# Altium schematic sheet IDC_EXT_Connectors.SchDoc
size 420 x 297 mm; DocumentNumber: 5; SheetNumber: 5; SheetTotal: 8; EDA_Number: ARTIQ; ModifiedBy: -; Title2: -; DivGrp: ISE; ModifiedDate: -
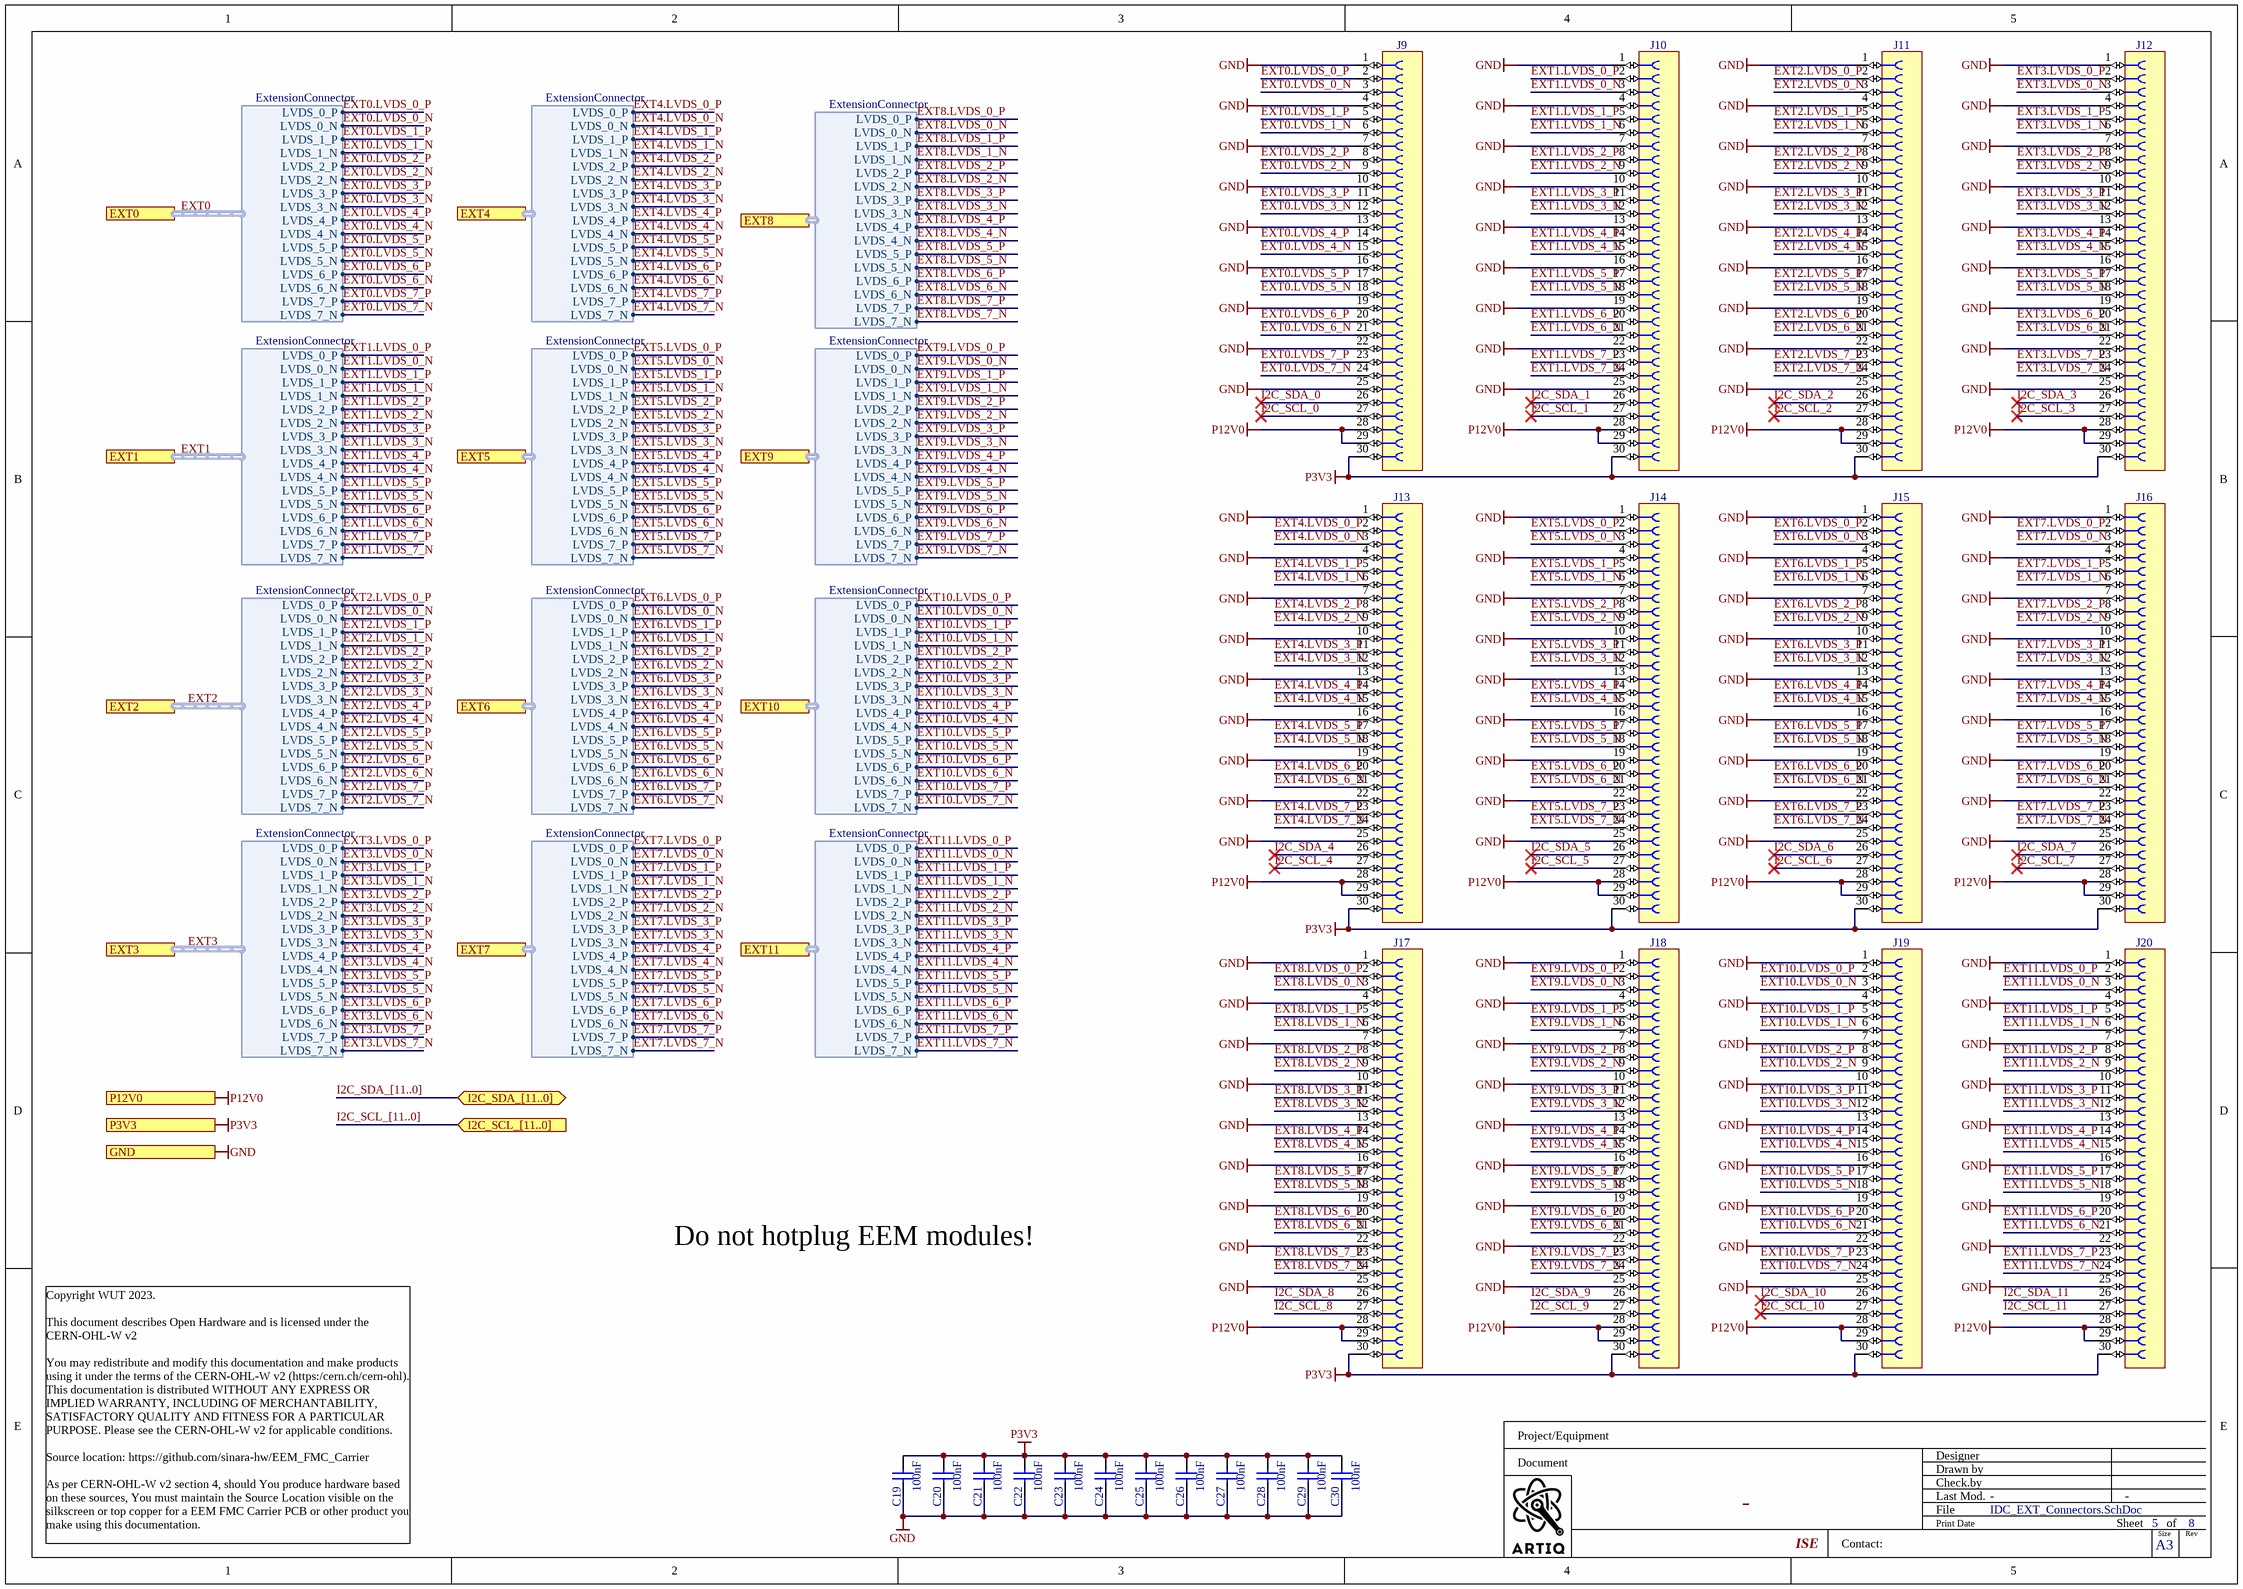
[diagram p0: IDC_EXT_Connectors.SchDoc]

## Parts
C19  100nF  [CAPC0603X33N]
C20  100nF  [CAPC0603X33N]
C21  100nF  [CAPC0603X33N]
C22  100nF  [CAPC0603X33N]
C23  100nF  [CAPC0603X33N]
C24  100nF  [CAPC0603X33N]
C25  100nF  [CAPC0603X33N]
C26  100nF  [CAPC0603X33N]
C27  100nF  [CAPC0603X33N]
C28  100nF  [CAPC0603X33N]
C29  100nF  [CAPC0603X33N]
C30  100nF  [CAPC0603X33N]
J9  (no value)  [SAMTEC_ESW-115-44-L-D]
J10  (no value)  [SAMTEC_ESW-115-44-L-D]
J11  (no value)  [SAMTEC_ESW-115-44-L-D]
J12  (no value)  [SAMTEC_ESW-115-44-L-D]
J13  (no value)  [SAMTEC_ESW-115-44-L-D]
J14  (no value)  [SAMTEC_ESW-115-44-L-D]
J15  (no value)  [SAMTEC_ESW-115-44-L-D]
J16  (no value)  [SAMTEC_ESW-115-44-L-D]
J17  (no value)  [SAMTEC_ESW-115-44-L-D]
J18  (no value)  [SAMTEC_ESW-115-44-L-D]
J19  (no value)  [SAMTEC_ESW-115-44-L-D]
J20  (no value)  [SAMTEC_ESW-115-44-L-D]

## Ports
EXT0 (harness ExtensionConnector), EXT1 (harness ExtensionConnector), EXT2 (harness ExtensionConnector), EXT3 (harness ExtensionConnector), EXT4 (harness ExtensionConnector), EXT5 (harness ExtensionConnector), EXT6 (harness ExtensionConnector), EXT7 (harness ExtensionConnector), EXT8 (harness ExtensionConnector), EXT9 (harness ExtensionConnector), EXT10 (harness ExtensionConnector), EXT11 (harness ExtensionConnector), GND, I2C_SCL_[11..0] (in), I2C_SDA_[11..0] (bidir), P3V3 (out), P12V0 (in)

## Harnesses
ExtensionConnector: LVDS_0_N, LVDS_0_P, LVDS_1_N, LVDS_1_P, LVDS_2_N, LVDS_2_P, LVDS_3_N, LVDS_3_P, LVDS_4_N, LVDS_4_P, LVDS_5_N, LVDS_5_P, LVDS_6_N, LVDS_6_P, LVDS_7_N, LVDS_7_P

## Nets
GND: C19.1 C20.1 C21.1 C22.1 C23.1 C24.1 C25.1 C26.1 C27.1 C28.1 C29.1 C30.1 J9.1 J9.4 J9.7 J9.10 J9.13 J9.16 J9.19 J9.22 J9.25 J10.1 J10.4 J10.7 J10.10 J10.13 J10.16 J10.19 J10.22 J10.25 J11.1 J11.4 J11.7 J11.10 J11.13 J11.16 J11.19 J11.22 J11.25 J12.1 J12.4 J12.7 J12.10 J12.13 J12.16 J12.19 J12.22 J12.25 J13.1 J13.4 J13.7 J13.10 J13.13 J13.16 J13.19 J13.22 J13.25 J14.1 J14.4 J14.7 J14.10 J14.13 J14.16 J14.19 J14.22 J14.25 J15.1 J15.4 J15.7 J15.10 J15.13 J15.16 J15.19 J15.22 J15.25 J16.1 J16.4 J16.7 J16.10 J16.13 J16.16 J16.19 J16.22 J16.25 J17.1 J17.4 J17.7 J17.10 J17.13 J17.16 J17.19 J17.22 J17.25 J18.1 J18.4 J18.7 J18.10 J18.13 J18.16 J18.19 J18.22 J18.25 J19.1 J19.4 J19.7 J19.10 J19.13 J19.16 J19.19 J19.22 J19.25 J20.1 J20.4 J20.7 J20.10 J20.13 J20.16 J20.19 J20.22 J20.25 ; port GND
P3V3: C19.2 C20.2 C21.2 C22.2 C23.2 C24.2 C25.2 C26.2 C27.2 C28.2 C29.2 C30.2 J9.30 J10.30 J11.30 J12.30 J13.30 J14.30 J15.30 J16.30 J17.30 J18.30 J19.30 J20.30 ; port P3V3
P12V0: J9.28 J9.29 J10.28 J10.29 J11.28 J11.29 J12.28 J12.29 J13.28 J13.29 J14.28 J14.29 J15.28 J15.29 J16.28 J16.29 J17.28 J17.29 J18.28 J18.29 J19.28 J19.29 J20.28 J20.29 ; port P12V0
EXT0.LVDS_0_N: J9.3 ; port EXT0.LVDS_0_N
EXT0.LVDS_0_P: J9.2 ; port EXT0.LVDS_0_P
EXT0.LVDS_1_N: J9.6 ; port EXT0.LVDS_1_N
EXT0.LVDS_1_P: J9.5 ; port EXT0.LVDS_1_P
EXT0.LVDS_2_N: J9.9 ; port EXT0.LVDS_2_N
EXT0.LVDS_2_P: J9.8 ; port EXT0.LVDS_2_P
EXT0.LVDS_3_N: J9.12 ; port EXT0.LVDS_3_N
EXT0.LVDS_3_P: J9.11 ; port EXT0.LVDS_3_P
EXT0.LVDS_4_N: J9.15 ; port EXT0.LVDS_4_N
EXT0.LVDS_4_P: J9.14 ; port EXT0.LVDS_4_P
EXT0.LVDS_5_N: J9.18 ; port EXT0.LVDS_5_N
EXT0.LVDS_5_P: J9.17 ; port EXT0.LVDS_5_P
EXT0.LVDS_6_N: J9.21 ; port EXT0.LVDS_6_N
EXT0.LVDS_6_P: J9.20 ; port EXT0.LVDS_6_P
EXT0.LVDS_7_N: J9.24 ; port EXT0.LVDS_7_N
EXT0.LVDS_7_P: J9.23 ; port EXT0.LVDS_7_P
EXT1.LVDS_0_N: J10.3 ; port EXT1.LVDS_0_N
EXT1.LVDS_0_P: J10.2 ; port EXT1.LVDS_0_P
EXT1.LVDS_1_N: J10.6 ; port EXT1.LVDS_1_N
EXT1.LVDS_1_P: J10.5 ; port EXT1.LVDS_1_P
EXT1.LVDS_2_N: J10.9 ; port EXT1.LVDS_2_N
EXT1.LVDS_2_P: J10.8 ; port EXT1.LVDS_2_P
EXT1.LVDS_3_N: J10.12 ; port EXT1.LVDS_3_N
EXT1.LVDS_3_P: J10.11 ; port EXT1.LVDS_3_P
EXT1.LVDS_4_N: J10.15 ; port EXT1.LVDS_4_N
EXT1.LVDS_4_P: J10.14 ; port EXT1.LVDS_4_P
EXT1.LVDS_5_N: J10.18 ; port EXT1.LVDS_5_N
EXT1.LVDS_5_P: J10.17 ; port EXT1.LVDS_5_P
EXT1.LVDS_6_N: J10.21 ; port EXT1.LVDS_6_N
EXT1.LVDS_6_P: J10.20 ; port EXT1.LVDS_6_P
EXT1.LVDS_7_N: J10.24 ; port EXT1.LVDS_7_N
EXT1.LVDS_7_P: J10.23 ; port EXT1.LVDS_7_P
EXT2.LVDS_0_N: J11.3 ; port EXT2.LVDS_0_N
EXT2.LVDS_0_P: J11.2 ; port EXT2.LVDS_0_P
EXT2.LVDS_1_N: J11.6 ; port EXT2.LVDS_1_N
EXT2.LVDS_1_P: J11.5 ; port EXT2.LVDS_1_P
EXT2.LVDS_2_N: J11.9 ; port EXT2.LVDS_2_N
EXT2.LVDS_2_P: J11.8 ; port EXT2.LVDS_2_P
EXT2.LVDS_3_N: J11.12 ; port EXT2.LVDS_3_N
EXT2.LVDS_3_P: J11.11 ; port EXT2.LVDS_3_P
EXT2.LVDS_4_N: J11.15 ; port EXT2.LVDS_4_N
EXT2.LVDS_4_P: J11.14 ; port EXT2.LVDS_4_P
EXT2.LVDS_5_N: J11.18 ; port EXT2.LVDS_5_N
EXT2.LVDS_5_P: J11.17 ; port EXT2.LVDS_5_P
EXT2.LVDS_6_N: J11.21 ; port EXT2.LVDS_6_N
EXT2.LVDS_6_P: J11.20 ; port EXT2.LVDS_6_P
EXT2.LVDS_7_N: J11.24 ; port EXT2.LVDS_7_N
EXT2.LVDS_7_P: J11.23 ; port EXT2.LVDS_7_P
EXT3.LVDS_0_N: J12.3 ; port EXT3.LVDS_0_N
EXT3.LVDS_0_P: J12.2 ; port EXT3.LVDS_0_P
EXT3.LVDS_1_N: J12.6 ; port EXT3.LVDS_1_N
EXT3.LVDS_1_P: J12.5 ; port EXT3.LVDS_1_P
EXT3.LVDS_2_N: J12.9 ; port EXT3.LVDS_2_N
EXT3.LVDS_2_P: J12.8 ; port EXT3.LVDS_2_P
EXT3.LVDS_3_N: J12.12 ; port EXT3.LVDS_3_N
EXT3.LVDS_3_P: J12.11 ; port EXT3.LVDS_3_P
EXT3.LVDS_4_N: J12.15 ; port EXT3.LVDS_4_N
EXT3.LVDS_4_P: J12.14 ; port EXT3.LVDS_4_P
EXT3.LVDS_5_N: J12.18 ; port EXT3.LVDS_5_N
EXT3.LVDS_5_P: J12.17 ; port EXT3.LVDS_5_P
EXT3.LVDS_6_N: J12.21 ; port EXT3.LVDS_6_N
EXT3.LVDS_6_P: J12.20 ; port EXT3.LVDS_6_P
EXT3.LVDS_7_N: J12.24 ; port EXT3.LVDS_7_N
EXT3.LVDS_7_P: J12.23 ; port EXT3.LVDS_7_P
EXT4.LVDS_0_N: J13.3 ; port EXT4.LVDS_0_N
EXT4.LVDS_0_P: J13.2 ; port EXT4.LVDS_0_P
EXT4.LVDS_1_N: J13.6 ; port EXT4.LVDS_1_N
EXT4.LVDS_1_P: J13.5 ; port EXT4.LVDS_1_P
EXT4.LVDS_2_N: J13.9 ; port EXT4.LVDS_2_N
EXT4.LVDS_2_P: J13.8 ; port EXT4.LVDS_2_P
EXT4.LVDS_3_N: J13.12 ; port EXT4.LVDS_3_N
EXT4.LVDS_3_P: J13.11 ; port EXT4.LVDS_3_P
EXT4.LVDS_4_N: J13.15 ; port EXT4.LVDS_4_N
EXT4.LVDS_4_P: J13.14 ; port EXT4.LVDS_4_P
EXT4.LVDS_5_N: J13.18 ; port EXT4.LVDS_5_N
EXT4.LVDS_5_P: J13.17 ; port EXT4.LVDS_5_P
EXT4.LVDS_6_N: J13.21 ; port EXT4.LVDS_6_N
EXT4.LVDS_6_P: J13.20 ; port EXT4.LVDS_6_P
EXT4.LVDS_7_N: J13.24 ; port EXT4.LVDS_7_N
EXT4.LVDS_7_P: J13.23 ; port EXT4.LVDS_7_P
EXT5.LVDS_0_N: J14.3 ; port EXT5.LVDS_0_N
EXT5.LVDS_0_P: J14.2 ; port EXT5.LVDS_0_P
EXT5.LVDS_1_N: J14.6 ; port EXT5.LVDS_1_N
EXT5.LVDS_1_P: J14.5 ; port EXT5.LVDS_1_P
EXT5.LVDS_2_N: J14.9 ; port EXT5.LVDS_2_N
EXT5.LVDS_2_P: J14.8 ; port EXT5.LVDS_2_P
EXT5.LVDS_3_N: J14.12 ; port EXT5.LVDS_3_N
EXT5.LVDS_3_P: J14.11 ; port EXT5.LVDS_3_P
EXT5.LVDS_4_N: J14.15 ; port EXT5.LVDS_4_N
EXT5.LVDS_4_P: J14.14 ; port EXT5.LVDS_4_P
EXT5.LVDS_5_N: J14.18 ; port EXT5.LVDS_5_N
EXT5.LVDS_5_P: J14.17 ; port EXT5.LVDS_5_P
EXT5.LVDS_6_N: J14.21 ; port EXT5.LVDS_6_N
EXT5.LVDS_6_P: J14.20 ; port EXT5.LVDS_6_P
EXT5.LVDS_7_N: J14.24 ; port EXT5.LVDS_7_N
EXT5.LVDS_7_P: J14.23 ; port EXT5.LVDS_7_P
EXT6.LVDS_0_N: J15.3 ; port EXT6.LVDS_0_N
EXT6.LVDS_0_P: J15.2 ; port EXT6.LVDS_0_P
EXT6.LVDS_1_N: J15.6 ; port EXT6.LVDS_1_N
EXT6.LVDS_1_P: J15.5 ; port EXT6.LVDS_1_P
EXT6.LVDS_2_N: J15.9 ; port EXT6.LVDS_2_N
EXT6.LVDS_2_P: J15.8 ; port EXT6.LVDS_2_P
EXT6.LVDS_3_N: J15.12 ; port EXT6.LVDS_3_N
EXT6.LVDS_3_P: J15.11 ; port EXT6.LVDS_3_P
EXT6.LVDS_4_N: J15.15 ; port EXT6.LVDS_4_N
EXT6.LVDS_4_P: J15.14 ; port EXT6.LVDS_4_P
EXT6.LVDS_5_N: J15.18 ; port EXT6.LVDS_5_N
EXT6.LVDS_5_P: J15.17 ; port EXT6.LVDS_5_P
EXT6.LVDS_6_N: J15.21 ; port EXT6.LVDS_6_N
EXT6.LVDS_6_P: J15.20 ; port EXT6.LVDS_6_P
EXT6.LVDS_7_N: J15.24 ; port EXT6.LVDS_7_N
EXT6.LVDS_7_P: J15.23 ; port EXT6.LVDS_7_P
EXT7.LVDS_0_N: J16.3 ; port EXT7.LVDS_0_N
EXT7.LVDS_0_P: J16.2 ; port EXT7.LVDS_0_P
EXT7.LVDS_1_N: J16.6 ; port EXT7.LVDS_1_N
EXT7.LVDS_1_P: J16.5 ; port EXT7.LVDS_1_P
EXT7.LVDS_2_N: J16.9 ; port EXT7.LVDS_2_N
EXT7.LVDS_2_P: J16.8 ; port EXT7.LVDS_2_P
EXT7.LVDS_3_N: J16.12 ; port EXT7.LVDS_3_N
EXT7.LVDS_3_P: J16.11 ; port EXT7.LVDS_3_P
EXT7.LVDS_4_N: J16.15 ; port EXT7.LVDS_4_N
EXT7.LVDS_4_P: J16.14 ; port EXT7.LVDS_4_P
EXT7.LVDS_5_N: J16.18 ; port EXT7.LVDS_5_N
EXT7.LVDS_5_P: J16.17 ; port EXT7.LVDS_5_P
EXT7.LVDS_6_N: J16.21 ; port EXT7.LVDS_6_N
EXT7.LVDS_6_P: J16.20 ; port EXT7.LVDS_6_P
EXT7.LVDS_7_N: J16.24 ; port EXT7.LVDS_7_N
EXT7.LVDS_7_P: J16.23 ; port EXT7.LVDS_7_P
EXT8.LVDS_0_N: J17.3 ; port EXT8.LVDS_0_N
EXT8.LVDS_0_P: J17.2 ; port EXT8.LVDS_0_P
EXT8.LVDS_1_N: J17.6 ; port EXT8.LVDS_1_N
EXT8.LVDS_1_P: J17.5 ; port EXT8.LVDS_1_P
EXT8.LVDS_2_N: J17.9 ; port EXT8.LVDS_2_N
EXT8.LVDS_2_P: J17.8 ; port EXT8.LVDS_2_P
EXT8.LVDS_3_N: J17.12 ; port EXT8.LVDS_3_N
EXT8.LVDS_3_P: J17.11 ; port EXT8.LVDS_3_P
EXT8.LVDS_4_N: J17.15 ; port EXT8.LVDS_4_N
EXT8.LVDS_4_P: J17.14 ; port EXT8.LVDS_4_P
EXT8.LVDS_5_N: J17.18 ; port EXT8.LVDS_5_N
EXT8.LVDS_5_P: J17.17 ; port EXT8.LVDS_5_P
EXT8.LVDS_6_N: J17.21 ; port EXT8.LVDS_6_N
EXT8.LVDS_6_P: J17.20 ; port EXT8.LVDS_6_P
EXT8.LVDS_7_N: J17.24 ; port EXT8.LVDS_7_N
EXT8.LVDS_7_P: J17.23 ; port EXT8.LVDS_7_P
EXT9.LVDS_0_N: J18.3 ; port EXT9.LVDS_0_N
EXT9.LVDS_0_P: J18.2 ; port EXT9.LVDS_0_P
EXT9.LVDS_1_N: J18.6 ; port EXT9.LVDS_1_N
EXT9.LVDS_1_P: J18.5 ; port EXT9.LVDS_1_P
EXT9.LVDS_2_N: J18.9 ; port EXT9.LVDS_2_N
EXT9.LVDS_2_P: J18.8 ; port EXT9.LVDS_2_P
EXT9.LVDS_3_N: J18.12 ; port EXT9.LVDS_3_N
EXT9.LVDS_3_P: J18.11 ; port EXT9.LVDS_3_P
EXT9.LVDS_4_N: J18.15 ; port EXT9.LVDS_4_N
EXT9.LVDS_4_P: J18.14 ; port EXT9.LVDS_4_P
EXT9.LVDS_5_N: J18.18 ; port EXT9.LVDS_5_N
EXT9.LVDS_5_P: J18.17 ; port EXT9.LVDS_5_P
EXT9.LVDS_6_N: J18.21 ; port EXT9.LVDS_6_N
EXT9.LVDS_6_P: J18.20 ; port EXT9.LVDS_6_P
EXT9.LVDS_7_N: J18.24 ; port EXT9.LVDS_7_N
EXT9.LVDS_7_P: J18.23 ; port EXT9.LVDS_7_P
EXT10.LVDS_0_N: J19.3 ; port EXT10.LVDS_0_N
EXT10.LVDS_0_P: J19.2 ; port EXT10.LVDS_0_P
EXT10.LVDS_1_N: J19.6 ; port EXT10.LVDS_1_N
EXT10.LVDS_1_P: J19.5 ; port EXT10.LVDS_1_P
EXT10.LVDS_2_N: J19.9 ; port EXT10.LVDS_2_N
EXT10.LVDS_2_P: J19.8 ; port EXT10.LVDS_2_P
EXT10.LVDS_3_N: J19.12 ; port EXT10.LVDS_3_N
EXT10.LVDS_3_P: J19.11 ; port EXT10.LVDS_3_P
EXT10.LVDS_4_N: J19.15 ; port EXT10.LVDS_4_N
EXT10.LVDS_4_P: J19.14 ; port EXT10.LVDS_4_P
EXT10.LVDS_5_N: J19.18 ; port EXT10.LVDS_5_N
EXT10.LVDS_5_P: J19.17 ; port EXT10.LVDS_5_P
EXT10.LVDS_6_N: J19.21 ; port EXT10.LVDS_6_N
EXT10.LVDS_6_P: J19.20 ; port EXT10.LVDS_6_P
EXT10.LVDS_7_N: J19.24 ; port EXT10.LVDS_7_N
EXT10.LVDS_7_P: J19.23 ; port EXT10.LVDS_7_P
EXT11.LVDS_0_N: J20.3 ; port EXT11.LVDS_0_N
EXT11.LVDS_0_P: J20.2 ; port EXT11.LVDS_0_P
EXT11.LVDS_1_N: J20.6 ; port EXT11.LVDS_1_N
EXT11.LVDS_1_P: J20.5 ; port EXT11.LVDS_1_P
EXT11.LVDS_2_N: J20.9 ; port EXT11.LVDS_2_N
EXT11.LVDS_2_P: J20.8 ; port EXT11.LVDS_2_P
EXT11.LVDS_3_N: J20.12 ; port EXT11.LVDS_3_N
EXT11.LVDS_3_P: J20.11 ; port EXT11.LVDS_3_P
EXT11.LVDS_4_N: J20.15 ; port EXT11.LVDS_4_N
EXT11.LVDS_4_P: J20.14 ; port EXT11.LVDS_4_P
EXT11.LVDS_5_N: J20.18 ; port EXT11.LVDS_5_N
EXT11.LVDS_5_P: J20.17 ; port EXT11.LVDS_5_P
EXT11.LVDS_6_N: J20.21 ; port EXT11.LVDS_6_N
EXT11.LVDS_6_P: J20.20 ; port EXT11.LVDS_6_P
EXT11.LVDS_7_N: J20.24 ; port EXT11.LVDS_7_N
EXT11.LVDS_7_P: J20.23 ; port EXT11.LVDS_7_P
I2C_SCL_0: J9.27
I2C_SCL_1: J10.27
I2C_SCL_2: J11.27
I2C_SCL_3: J12.27
I2C_SCL_4: J13.27
I2C_SCL_5: J14.27
I2C_SCL_6: J15.27
I2C_SCL_7: J16.27
I2C_SCL_8: J17.27
I2C_SCL_9: J18.27
I2C_SCL_10: J19.27
I2C_SCL_11: J20.27
I2C_SDA_0: J9.26
I2C_SDA_1: J10.26
I2C_SDA_2: J11.26
I2C_SDA_3: J12.26
I2C_SDA_4: J13.26
I2C_SDA_5: J14.26
I2C_SDA_6: J15.26
I2C_SDA_7: J16.26
I2C_SDA_8: J17.26
I2C_SDA_9: J18.26
I2C_SDA_10: J19.26
I2C_SDA_11: J20.26

## Buses and harness runs
bus I2C_SCL_[11..0] = port I2C_SCL_[11..0]
bus I2C_SDA_[11..0] = port I2C_SDA_[11..0]
harness EXT0 = port EXT0
harness EXT1 = port EXT1
harness EXT2 = port EXT2
harness EXT3 = port EXT3

## Notes on the sheet
- Do not hotplug EEM modules!
- Project/Equipment
- Document
- Designer
- Drawn by
- Check.by
- Copyright WUT 2023.
  This document describes Open Hardware and is licensed under the CERN-OHL-W v2
  You may redistribute and modify this documentation and make products using it under the terms of the CERN-OHL-W v2 (https:/cern.ch/cern-ohl). This documentation is distributed WITHOUT ANY EXPRESS OR IMPLIED WARRANTY, INCLUDING OF MERCHANTABILITY, SATISFACTORY QUALITY AND FITNESS FOR A PARTICULAR PURPOSE. Please see the CERN-OHL-W v2 for applicable conditions.
  Source location: https://github.com/sinara-hw/EEM_FMC_Carrier
  As per CERN-OHL-W v2 section 4, should You produce hardware based on these sources, You must maintain the Source Location visible on the silkscreen or top copper for a EEM FMC Carrier PCB or other product you make using this documentation.
- Contact:
- File
- Last Mod.
- Print Date
- Sheet
- Size
- A3
- of
- Rev

## Library data of the parts
C19-C30 = CC0201_100NF_6.3V_10%_X5R: Non-polarised capacitor; Part Description: SMD Multilayer Chip Ceramic Capacitor; Manufacturer: GENERIC; Manufacturer1 Part Number: 02016D104KAT2A; Voltage: 6.3V; TC: X5R; Tolerance: ±10%; Part Number: CC0201_100NF_6.3V_10%_X5R; Component Kind: Standard; Component Type: Standard; Pin Count: 2; Value: 100nF; Status: Not Recommended; Manufacturer Part Number: CC0201_100NF_6.3V_10%_X5R; Case: 0201; Mounted: Yes; Socket: No; SMD: Yes; Sense: No; Manufacturer1 Example: AVX; Manufacturer1 ComponentHeight: 0.33mm; HelpURL: \\cern.ch\dfs\Applications\Altium\Datasheets\CC0201_X5R_AVX.pdf; Author: CERN DEM JLC; CreateDate: 2007-12-03; LatestRevisionDate: 2007-12-03
J9-J20 = ESW-115-44-L-D: Elevated Socket Strip, 0.100" Pitch (2.54mm) Through Hole Gold, 30 pos, duble row; Manufacturer: Samtec; Pin_count: 30; Created_by: MKI; Checked_by: +++; Mount_technology: THT; Operating_temp: -55°C/+125°C; Part Number: ESW-115-44-L-D; Value: ESW-115-44-L-D; Case: *; Manufacturer_part_number: ESW-115-44-L-D; Type: Header/Socket